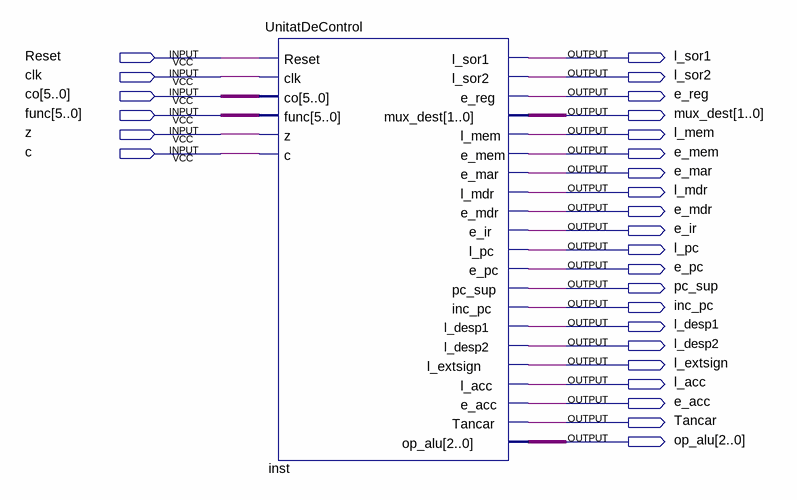
[diagram p0: schematic sheet]
// Quartus schematic UC_simbol.bdf as structural Verilog: 1 symbols, 27 pins
module UC_simbol (
  input  Reset,
  input  clk,
  input  [5:0] co,
  input  [5:0] func,
  input  z,
  input  c,
  output l_sor1,
  output l_sor2,
  output e_reg,
  output [1:0] mux_dest,
  output l_mem,
  output e_mem,
  output e_mar,
  output l_mdr,
  output e_mdr,
  output e_ir,
  output l_pc,
  output e_pc,
  output pc_sup,
  output inc_pc,
  output l_desp1,
  output l_desp2,
  output l_extsign,
  output l_acc,
  output e_acc,
  output Tancar,
  output [2:0] op_alu
);

  UnitatDeControl inst (
    .Reset(Reset), .clk(clk), .co(co), .func(func), .z(z), .c(c), .l_sor1(l_sor1), .l_sor2(l_sor2),
    .e_reg(e_reg), .mux_dest(mux_dest), .l_mem(l_mem), .e_mem(e_mem), .e_mar(e_mar), .l_mdr(l_mdr),
    .e_mdr(e_mdr), .e_ir(e_ir), .l_pc(l_pc), .e_pc(e_pc), .pc_sup(pc_sup), .inc_pc(inc_pc),
    .l_desp1(l_desp1), .l_desp2(l_desp2), .l_extsign(l_extsign), .l_acc(l_acc), .e_acc(e_acc),
    .Tancar(Tancar), .op_alu(op_alu));
endmodule
